# Altium project GRAVITAS_XTREME_SENSOR.PrjPcb
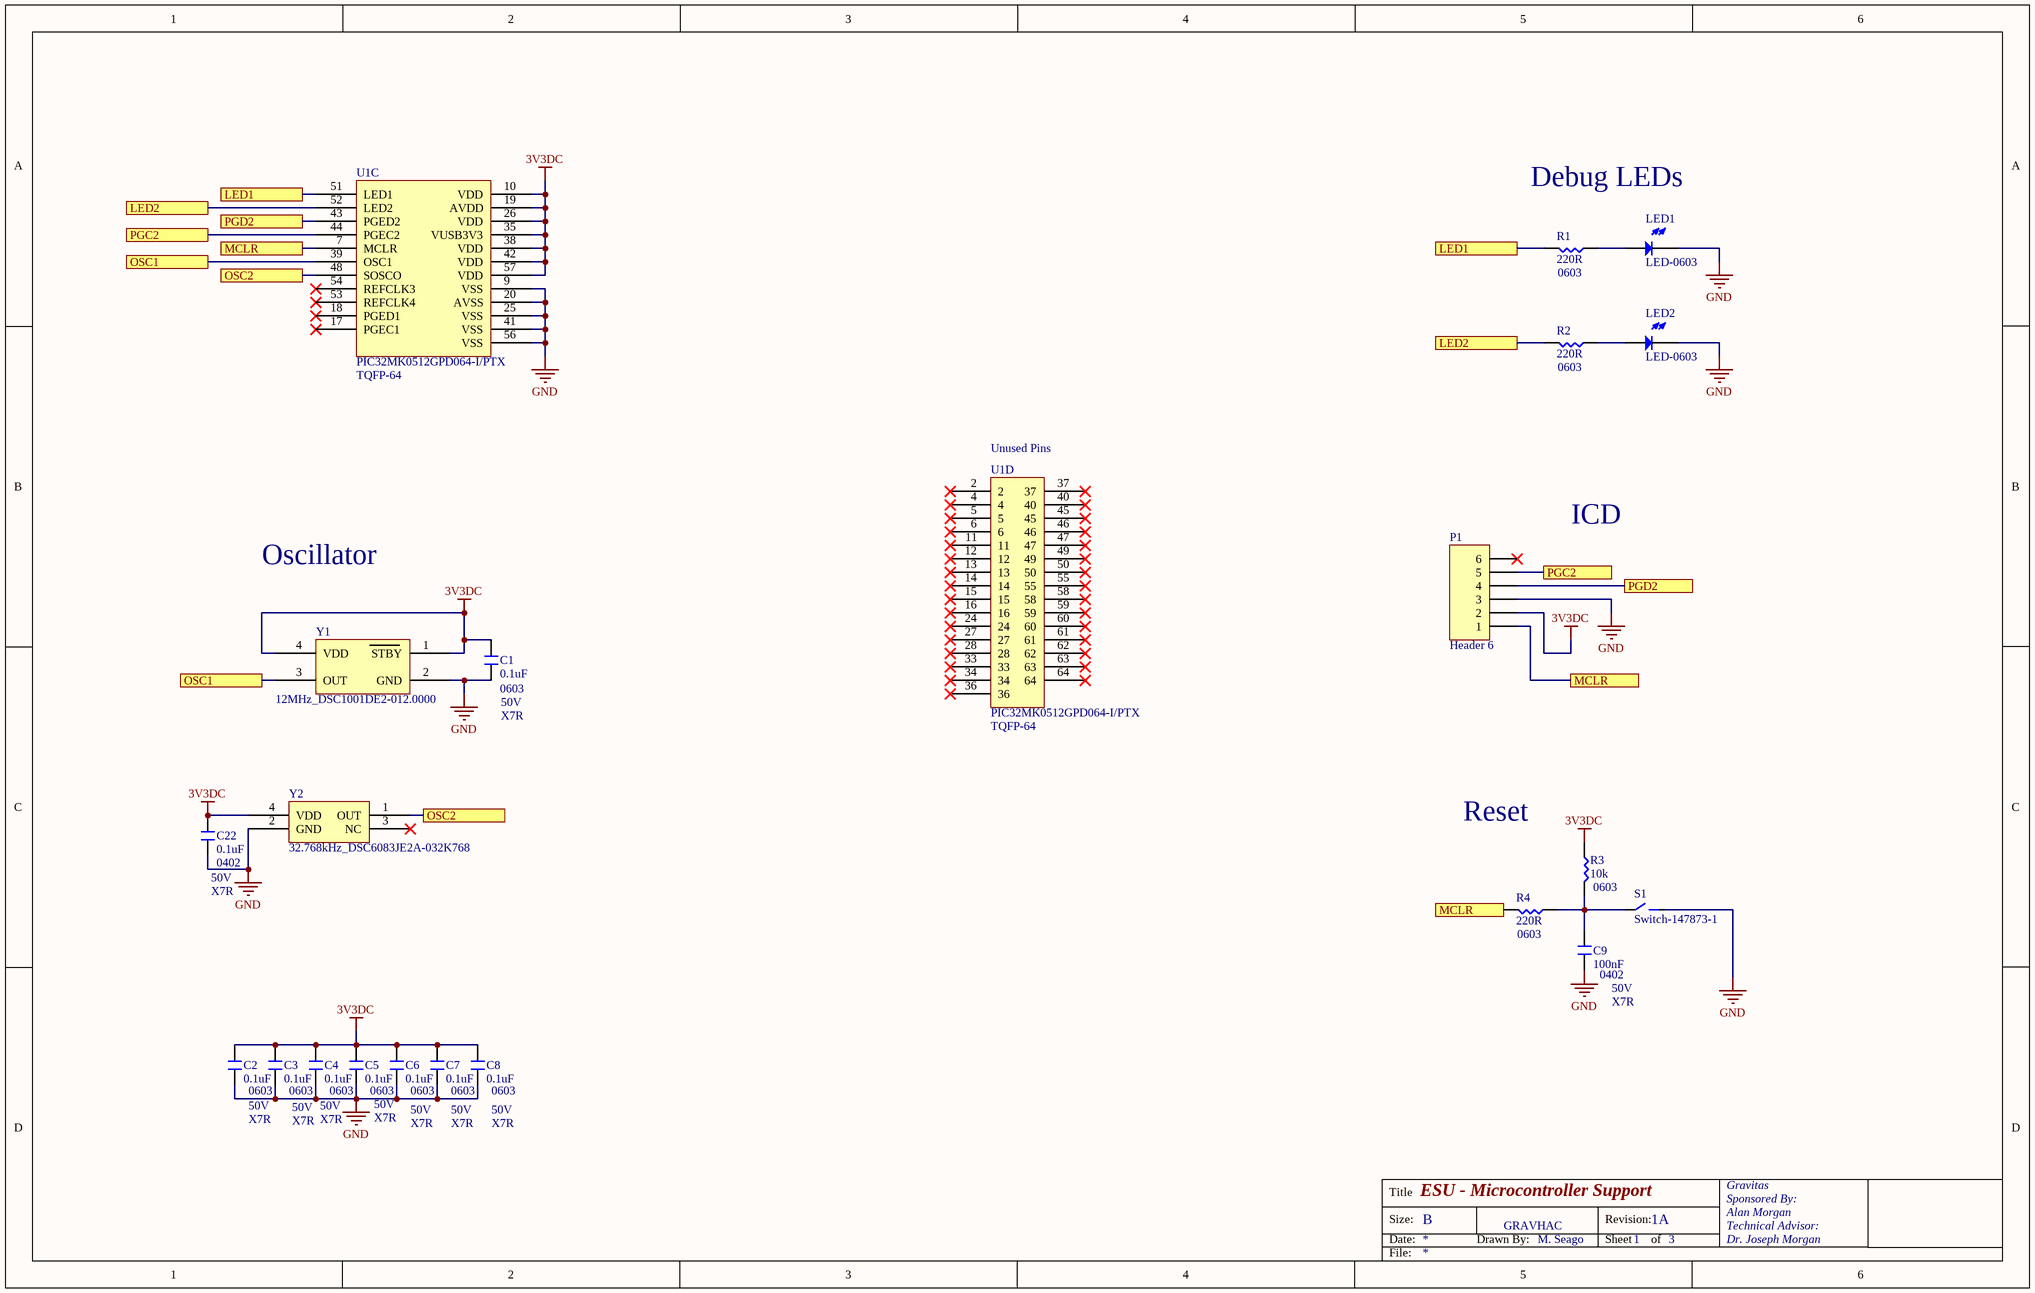
[diagram p0: MCU_SUPPORT_XS.SchDoc]
3 sheets, 63 parts. Net scope: flat (ports and power ports of the same name join across sheets).
Board file: GRAVITAS_XTREME_SENSOR.PcbDoc
Sheets:
  MCU_SUPPORT_XS.SchDoc
  SENSORS_XS.SchDoc
  VREG_RS485_XS.SchDoc

## Sheet MCU_SUPPORT_XS.SchDoc: ESU - Microcontroller Support
size B; DrawnBy: M. Seago; Organization: Gravitas; Address1: Sponsored By:; Address2: Alan Morgan; Address3: Technical Advisor:; Address4: Dr. Joseph Morgan; Revision: 1A; SheetNumber: 1; SheetTotal: 3

### Parts
(Parts that share a designator on the sheet are numbered #1, #2 ... from top to bottom, then left to right.)
C1  0.1uF  [NonPolar-0603]
C2  0.1uF  [NonPolar-0603]
C3  0.1uF  [NonPolar-0603]
C4  0.1uF  [NonPolar-0603]
C5  0.1uF  [NonPolar-0603]
C6  0.1uF  [NonPolar-0603]
C7  0.1uF  [NonPolar-0603]
C8  0.1uF  [NonPolar-0603]
C9  100nF  [NonPolar-0402]
C22  0.1uF  [NonPolar-0402]
LED1  LED-0603  [LED-0603]
LED2  LED-0603  [LED-0603]
P1  Header 6  [HDR1X6]
R1  220R  [NonPolar-0603]
R2  220R  [NonPolar-0603]
R3  10k  [NonPolar-0603]
R4  220R  [NonPolar-0603]
S1  Switch-147873-1  [Switch - 147873-1]
U1#1  PIC32MK0512GPD064-I/PTX  [PIC32MK0512GPD064]  (part C of 3)
U1#2  PIC32MK0512GPD064-I/PTX  [V2_PIC32MK0512GPD064IPT]  (part D of 4)
Y1  12MHz_DSC1001DE2-012.0000  [12MHz_DSC1001DE2-012.0000]
Y2  32.768kHz_DSC6083JE2A-032K768  [32.768kHz_DSC6083JE2A-032K768]

### Ports
LED1, LED2, MCLR, OSC1, OSC2, PGC2, PGD2

### Nets
3V3DC: C1.2 C2.2 C3.2 C4.2 C5.2 C6.2 C7.2 C8.2 C22.2 P1.2 R3.2 U1#1.10(VDD) U1#1.19(AVDD) U1#1.26(VDD) U1#1.35(VUSB3V3) U1#1.38(VDD) U1#1.42(VDD) U1#1.57(VDD) Y1.1(STBY) Y1.4(VDD) Y2.4(VDD)
GND: C1.1 C2.1 C3.1 C4.1 C5.1 C6.1 C7.1 C8.1 C9.1 C22.1 LED1.2 LED2.2 P1.3 S1.2 U1#1.9(VSS) U1#1.20(AVSS) U1#1.25(VSS) U1#1.41(VSS) U1#1.56(VSS) Y1.2(GND) Y2.2(GND)
NetC9_2: C9.2 R3.1 R4.2 S1.1
NetLED1_1: LED1.1 R1.2
NetLED2_1: LED2.1 R2.2
NetP1_1: P1.1 R4.1 U1#1.7(MCLR) ; port MCLR
NetP1_4: P1.4 U1#1.43(PGED2) ; port PGD2
NetP1_5: P1.5 U1#1.44(PGEC2) ; port PGC2
NetR1_1: R1.1 U1#1.51(LED1) ; port LED1
NetR2_1: R2.1 U1#1.52(LED2) ; port LED2
NetU1#1_39: U1#1.39(OSC1) Y1.3(OUT) ; port OSC1
NetU1#1_48: U1#1.48(SOSCO) Y2.1(OUT) ; port OSC2

Not connected (* = marked no-connect by the designer): P1 6*; U1#1 17(PGEC1)* 18(PGED1)* 53(REFCLK4)* 54(REFCLK3)*; U1#2 2* 4* 5* 6* 11* 12* 13* 14* 15* 16* 24* 27* 28* 33* 34* 36* 37* 40* 45* 46* 47* 49* 50* 55* 58* 59* 60* 61* 62* 63* 64*; Y2 3(NC)*

### Notes on the sheet
- Debug LEDs
- (near R1) 0603
- (near R2) 0603
- (near U1#1) TQFP-64
- (near U1#2) Unused Pins
- Oscillator
- ICD
- (near C1) 0603
- (near C1) 50V
- (near C1) X7R
- (near U1#2) TQFP-64
- Reset
- (near C22) 50V
- (near C22) X7R
- (near C22) 0402
- (near R3) 0603
- (near R4) 0603
- (near C9) 0402
- (near C9) 50V
- (near C9) X7R
- 0603
- 50V
- (near C8) 0603
- (near C8) 50V
- X7R
- GRAVHAC
- Title
- Size:
- Date:
- B
- Drawn By:
- Revision:
- Sheet
- of
- File:

### Library data of the parts
C1-C8 = Cap - 0603
C9 C22 = Cap - 0402
P1 = Header 6: Header, 6-Pin; LatestRevisionDate: 17-Jul-2002; LatestRevisionNote: Re-released for DXP Platform.; Publisher: Altium Limited
R1 = Res - 0603: 0603; Parameter 1: 0603
R2-R4 = Res - 0603

## Sheet SENSORS_XS.SchDoc: ESU - Sensors
size B; DrawnBy: M. Seago; Organization: Gravitas; Address1: Sponsored By:; Address2: Alan Morgan; Address3: Technical Advisor:; Address4: Dr. Joseph Morgan; Revision: 1A; SheetNumber: 2; SheetTotal: 3
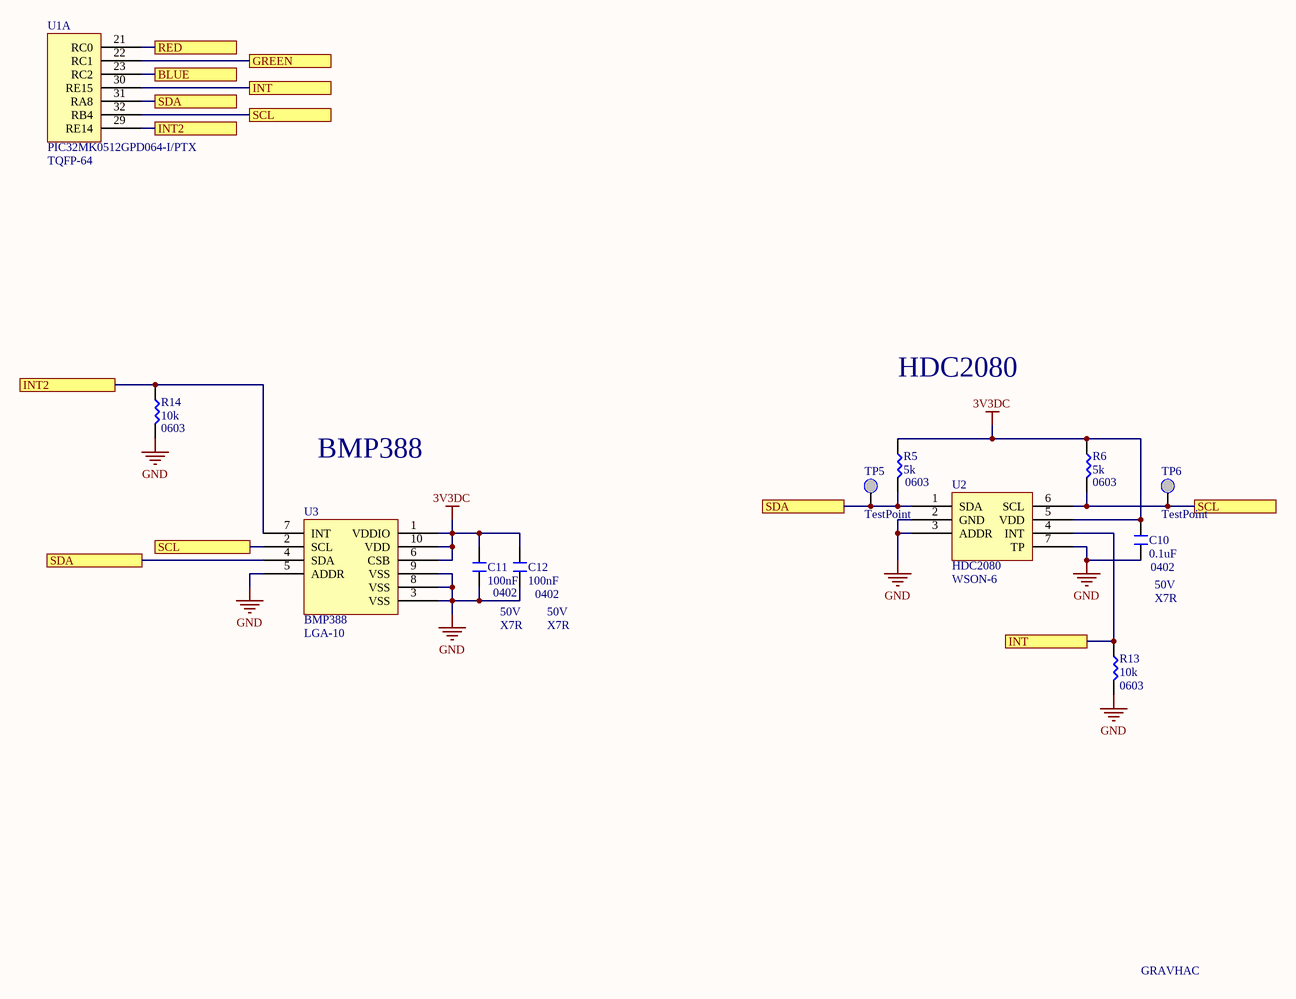
[diagram p1: SENSORS_XS.SchDoc]

### Parts
(Parts that share a designator on the sheet are numbered #1, #2 ... from top to bottom, then left to right.)
C10  0.1uF  [NonPolar-0402]
C11  100nF  [NonPolar-0402]
C12  100nF  [NonPolar-0402]
R5  5k  [NonPolar-0603]
R6  5k  [NonPolar-0603]
R13  10k  [NonPolar-0603]
R14  10k  [NonPolar-0603]
TP5  TestPoint  [TP - S2751-46R]
TP6  TestPoint  [TP - S2751-46R]
U1#1  PIC32MK0512GPD064-I/PTX  [PIC32MK0512GPD064]  (part A of 3)
U2  HDC2080  [HDC2080]
U3  BMP388  [BMP388]

### Ports
BLUE, GREEN, INT, INT2, RED, SCL, SDA

### Nets
3V3DC: C10.2 C11.2 C12.2 R5.2 R6.2 U2.5(VDD) U3.1(VDDIO) U3.6(CSB) U3.10(VDD)
GND: C10.1 C11.1 C12.1 R13.1 R14.1 U2.2(GND) U2.3(ADDR) U2.7(TP) U3.3(VSS) U3.5(ADDR) U3.8(VSS) U3.9(VSS)
NetR5_1: R5.1 TP5.1 U1#1.31(RA8) U2.1(SDA) U3.4(SDA) ; port SDA
NetR6_1: R6.1 TP6.1 U1#1.32(RB4) U2.6(SCL) U3.2(SCL) ; port SCL
NetR13_2: R13.2 U1#1.30(RE15) U2.4(INT) ; port INT
NetR14_2: R14.2 U1#1.29(RE14) U3.7(INT) ; port INT2
NetU1#1_21: U1#1.21(RC0) ; port RED
NetU1#1_22: U1#1.22(RC1) ; port GREEN
NetU1#1_23: U1#1.23(RC2) ; port BLUE

### Notes on the sheet
- (near U1#1) TQFP-64
- HDC2080
- (near R14) 0603
- BMP388
- (near R5) 0603
- (near R6) 0603
- (near U2) WSON-6
- (near C10) 0402
- (near C10) 50V
- (near U3) LGA-10
- 0402
- 50V
- X7R
- (near C12) 0402
- (near C12) 50V
- (near R13) 0603
- GRAVHAC
- Title
- Size:
- Date:
- B
- Drawn By:
- Revision:
- Sheet
- of
- File:

### Library data of the parts
C10-C12 = Cap - 0402
R5 R6 R13 R14 = Res - 0603
TP5 TP6 = TestPoint: S2751-46R

## Sheet VREG_RS485_XS.SchDoc: ESU - VREG/RS485
size B; DrawnBy: M. Seago; Organization: Gravitas; Address1: Sponsored By:; Address2: Alan Morgan; Address3: Technical Advisor:; Address4: Dr. Joseph Morgan; Revision: 1A; SheetNumber: 3; SheetTotal: 3
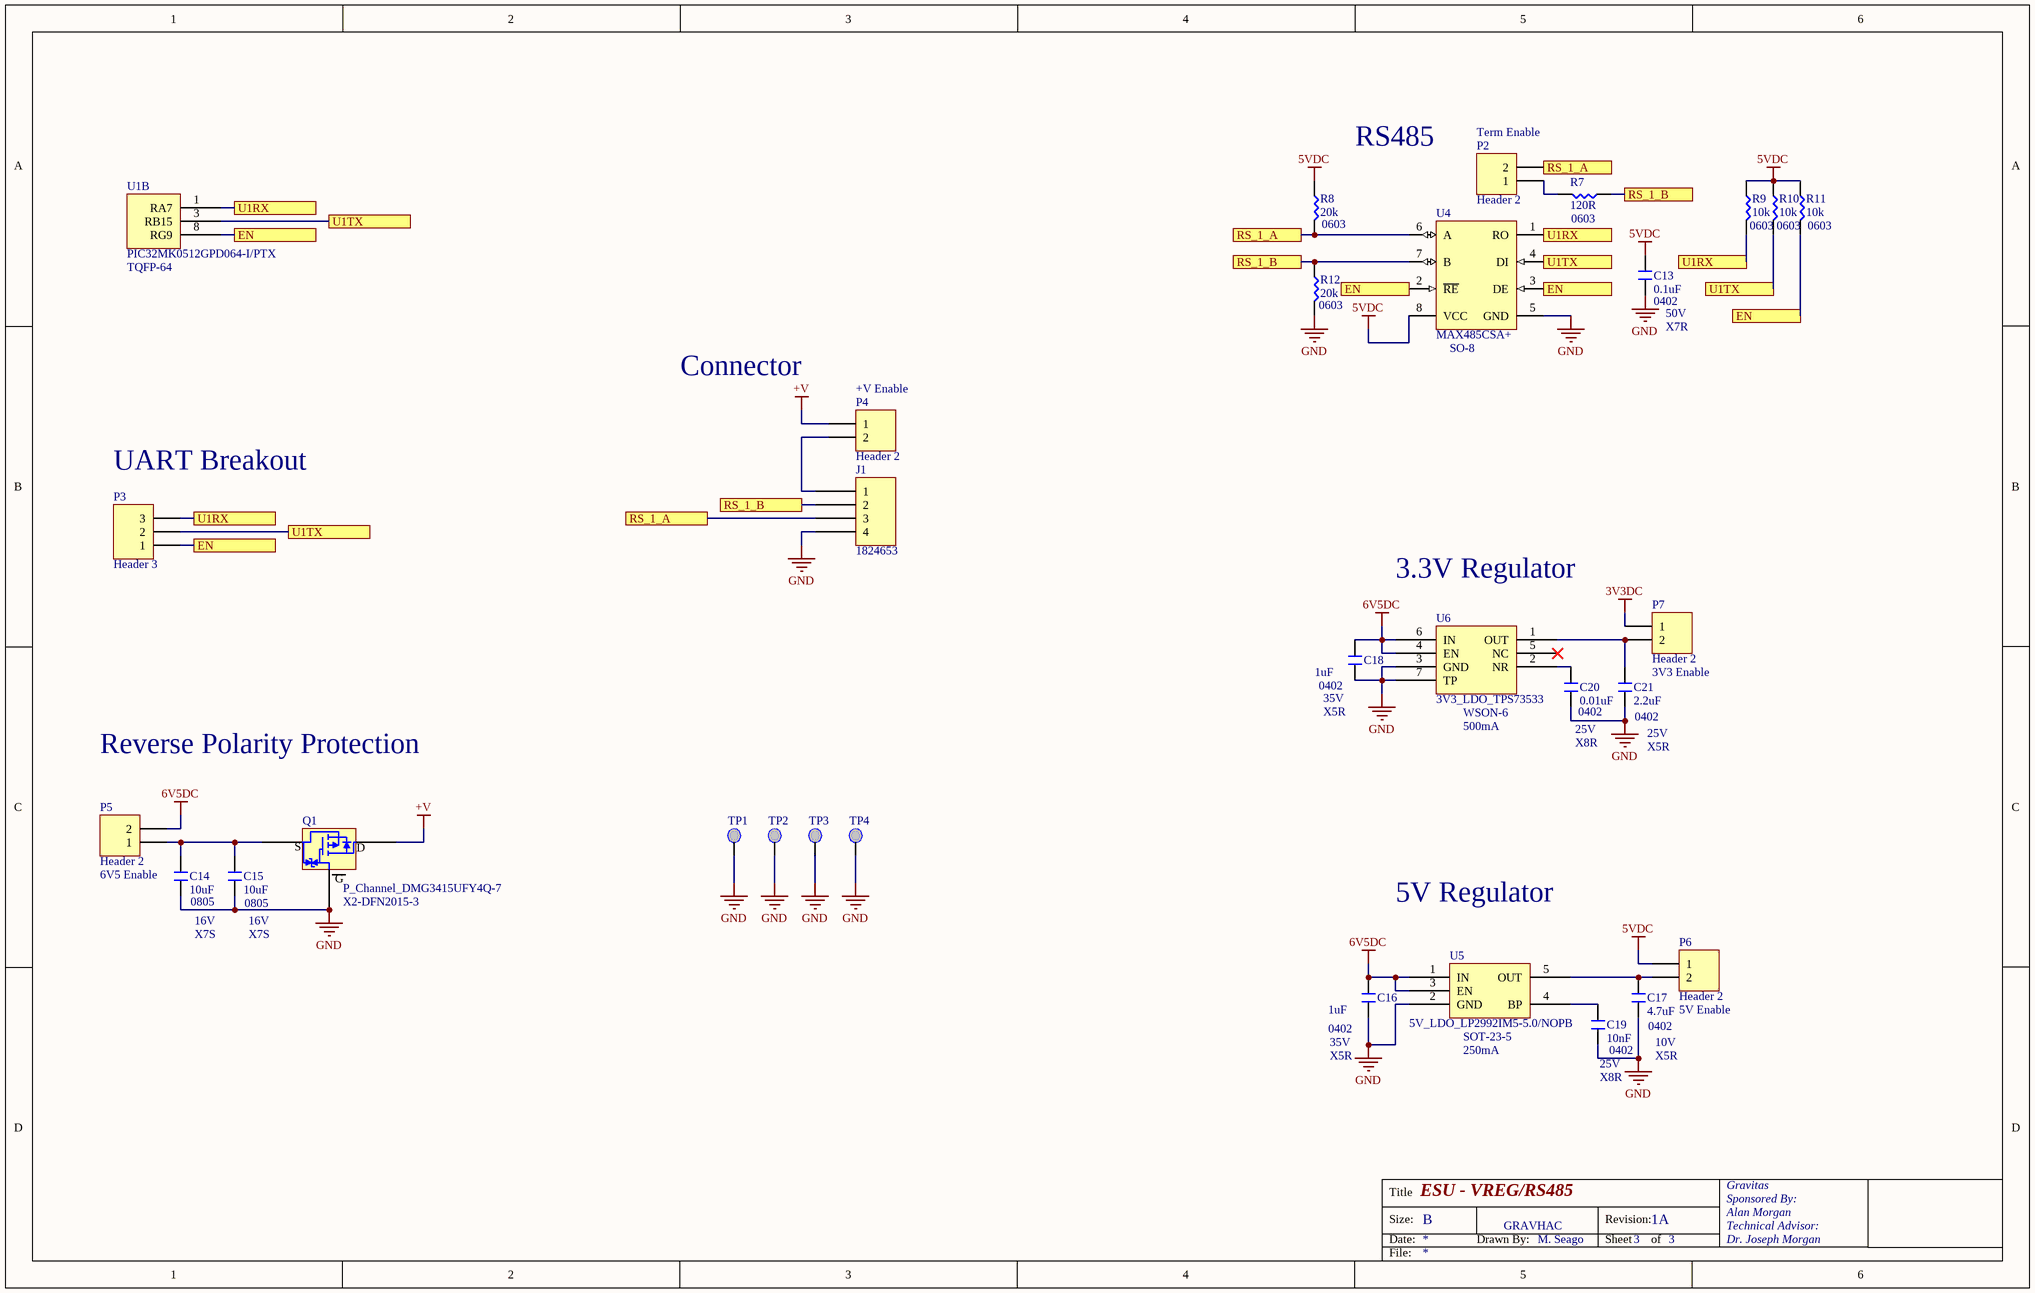
[diagram p2: VREG_RS485_XS.SchDoc]

### Parts
(Parts that share a designator on the sheet are numbered #1, #2 ... from top to bottom, then left to right.)
C13  0.1uF  [NonPolar-0402]
C14  10uF  [NonPolar-0805]
C15  10uF  [NonPolar-0805]
C16  1uF  [NonPolar-0402]
C17  4.7uF  [NonPolar-0402]
C18  1uF  [NonPolar-0402]
C19  10nF  [NonPolar-0402]
C20  0.01uF  [NonPolar-0402]
C21  2.2uF  [NonPolar-0402]
J1  1824653  [1824653]
P2  Header 2  [HDR1X2]
P3  Header 3  [HDR1X3]
P4  Header 2  [HDR1X2]
P5  Header 2  [HDR1X2]
P6  Header 2  [HDR1X2]
P7  Header 2  [HDR1X2]
Q1  P_Channel_DMG3415UFY4Q-7  [P_Channel_DMG3415UFY4Q-7_attempt1]
R7  120R  [NonPolar-0603]
R8  20k  [NonPolar-0603]
R9  10k  [NonPolar-0603]
R10  10k  [NonPolar-0603]
R11  10k  [NonPolar-0603]
R12  20k  [NonPolar-0603]
TP1  TestPoint  [TP - S2751-46R]  (value not drawn)
TP2  TestPoint  [TP - S2751-46R]  (value not drawn)
TP3  TestPoint  [TP - S2751-46R]  (value not drawn)
TP4  TestPoint  [TP - S2751-46R]  (value not drawn)
U1#1  PIC32MK0512GPD064-I/PTX  [PIC32MK0512GPD064]  (part B of 3)
U4  MAX485CSA+  [MAXM-MAX485CSA+-8_M]
U5  5V_LDO_LP2992IM5-5.0/NOPB  [LP2992IM5-5.0/NOPB]
U6  3V3_LDO_TPS73533  [TPS73533DRVT]

### Ports
EN, RS_1_A, RS_1_B, U1RX, U1TX

### Nets
3V3DC: P7.1
5VDC: C13.2 P6.1 R8.2 R9.2 R10.2 R11.2 U4.8(VCC)
6V5DC: C16.2 C18.2 P5.2 U5.1(IN) U5.3(EN) U6.4(EN) U6.6(IN)
+V: P4.1 Q1.3
GND: C13.1 C14.1 C15.1 C16.1 C17.1 C18.1 C19.1 C20.1 C21.1 J1.4 Q1.1 R12.1 TP1.1 TP2.1 TP3.1 TP4.1 U4.5(GND) U5.2(GND) U6.3(GND) U6.7(TP)
NetC14_2: C14.2 C15.2 P5.1 Q1.2
NetC17_2: C17.2 P6.2 U5.5(OUT)
NetC19_2: C19.2 U5.4(BP)
NetC20_2: C20.2 U6.2(NR)
NetC21_2: C21.2 P7.2 U6.1(OUT)
NetJ1_1: J1.1 P4.2
NetJ1_2: J1.2 R7.2 R12.2 U4.7(B) ; port RS_1_B
NetJ1_3: J1.3 P2.2 R8.1 U4.6(A) ; port RS_1_A
NetP2_1: P2.1 R7.1
NetP3_1: P3.1 R11.1 U1#1.8(RG9) U4.2(~{RE}) U4.3(DE) ; port EN
NetP3_2: P3.2 R10.1 U1#1.3(RB15) U4.4(DI) ; port U1TX
NetP3_3: P3.3 R9.1 U1#1.1(RA7) U4.1(RO) ; port U1RX

Not connected (* = marked no-connect by the designer): U6 5(NC)*

### Notes on the sheet
- RS485
- (near P2) Term Enable
- (near R8) 0603
- (near R7) 0603
- 0603
- (near R11) 0603
- (near U1#1) TQFP-64
- (near R12) 0603
- (near U4) SO-8
- (near C13) 0402
- (near C13) 50V
- (near C13) X7R
- Connector
- (near P4) +V Enable
- (near P3) UART Breakout
- 3.3V Regulator
- (near C18) 0402
- (near C18) 35V
- 3V3 Enable
- Reverse Polarity Protection
- (near C18) X5R
- (near U6) WSON-6
- (near U6) 500mA
- 25V
- X8R
- 0402
- (near C21) 0402
- (near C21) 25V
- X5R
- 6V5 Enable
- 0805
- (near C15) 0805
- (near Q1) X2-DFN2015-3
- 5V Regulator
- 16V
- X7S
- (near C16) 0402
- (near C16) 35V
- (near U5) SOT-23-5
- (near C17) 0402
- 10V
- 5V Enable
- (near C16) X5R
- (near U5) 250mA
- (near C19) 25V
- (near C19) X8R
- (near C19) 0402
- GRAVHAC
- Title
- Size:
- Date:
- B
- Drawn By:
- Revision:
- Sheet
- of
- File:
- (in symbol P_Channel_DMG3415UFY4Q-7) S; D; G

### Library data of the parts
C13 C16-C21 = Cap - 0402
C14 C15 = Cap - 0805
P2 P4-P7 = Header 2: Header, 2-Pin; LatestRevisionDate: 17-Jul-2002; LatestRevisionNote: Re-released for DXP Platform.; Publisher: Altium Limited
P3 = Header 3: Header, 3-Pin; LatestRevisionDate: 17-Jul-2002; LatestRevisionNote: Re-released for DXP Platform.; Publisher: Altium Limited
R7-R12 = Res - 0603
TP1-TP4 = TestPoint: S2751-46R
U4 = CMP-2000-05211-1: Low-Power, Slew-Rate-Limited RS-485/RS-422 Transceiver, 4.75 to 5.25 V, 0 to 70 degC, 8-Pin SOIC, RoHS, Tape and Reel; Manufacturer: Maxim; No. of Receivers: 1; Transceiver Type: Differential; Supply Voltage Min: 4.75V; IC Generic Number: 485; IC Temperature Range: Commercial; No. of Pins: 8; Supply Voltage Range: 4.75Vto5.25V; Interface: RS-422/RS-485; Supply Voltage Max: 5.25V; Data Rate: 2.5Mbps; Line / Bus Driver / Receiver / Transceiver Type: CMOSDifferential; Supply Current: 500µA; Interface Type: RS422,RS485; Device Type: Transceiver; Manufacturer URL: http://www.maximintegrated.com/; Operating Temperature Range: 0degCto+70degC; Package / Case: SOIC; Digital IC Case Style: SOIC; Operating Temperature Max: 70degC; Device Marking: MAX485CSA+; Driver Case Style: SOIC; Datasheet Version: Rev. 8, 10/2003; Operating Temperature Min: 0degC; Datasheet URL: https://datasheet.ciiva.com/29306/170071-da-01-en-ic-max485csa-so8-29306144.pdf; Base Number: 485; No. of Drivers: 1; Logic Function Number: 485

## Nets that join several sheets
3V3DC: MCU_SUPPORT_XS (21 pins), SENSORS_XS (9 pins), VREG_RS485_XS (P7.1)
GND: MCU_SUPPORT_XS (21 pins), SENSORS_XS (12 pins), VREG_RS485_XS (20 pins)